# EAGLE schematic draft9 (EAGLE 6.3)
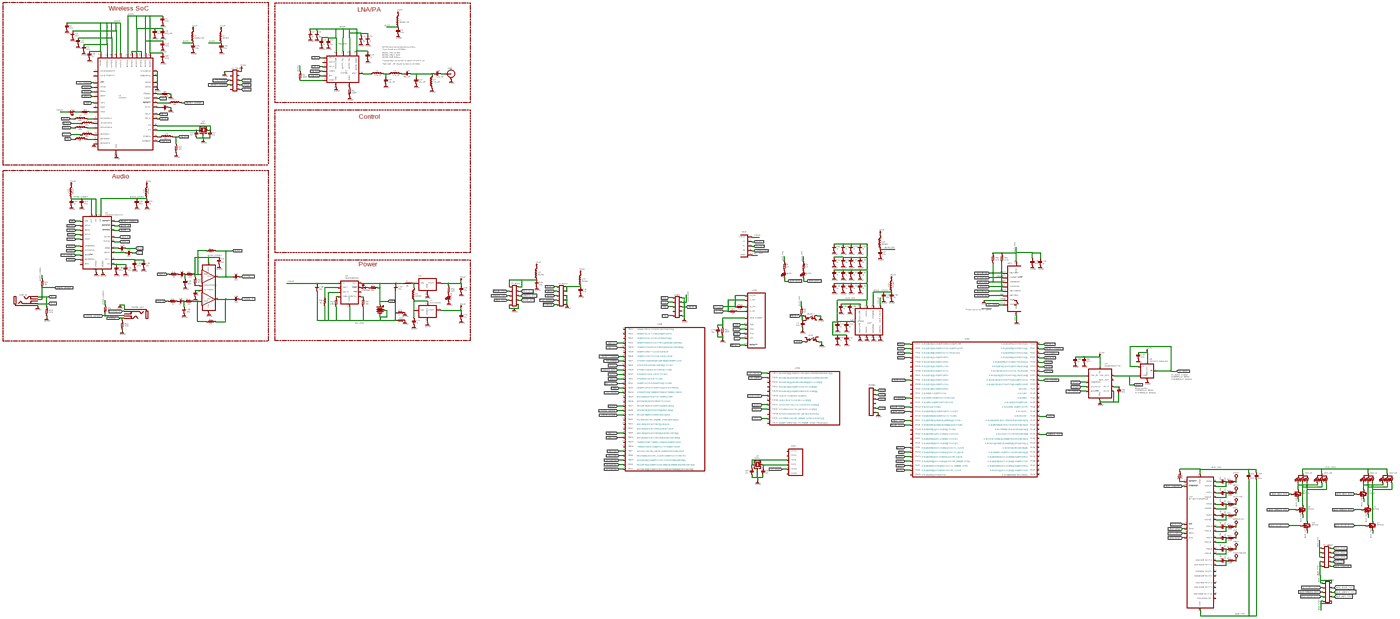
[diagram p0: schematic, sheet 1, overview]
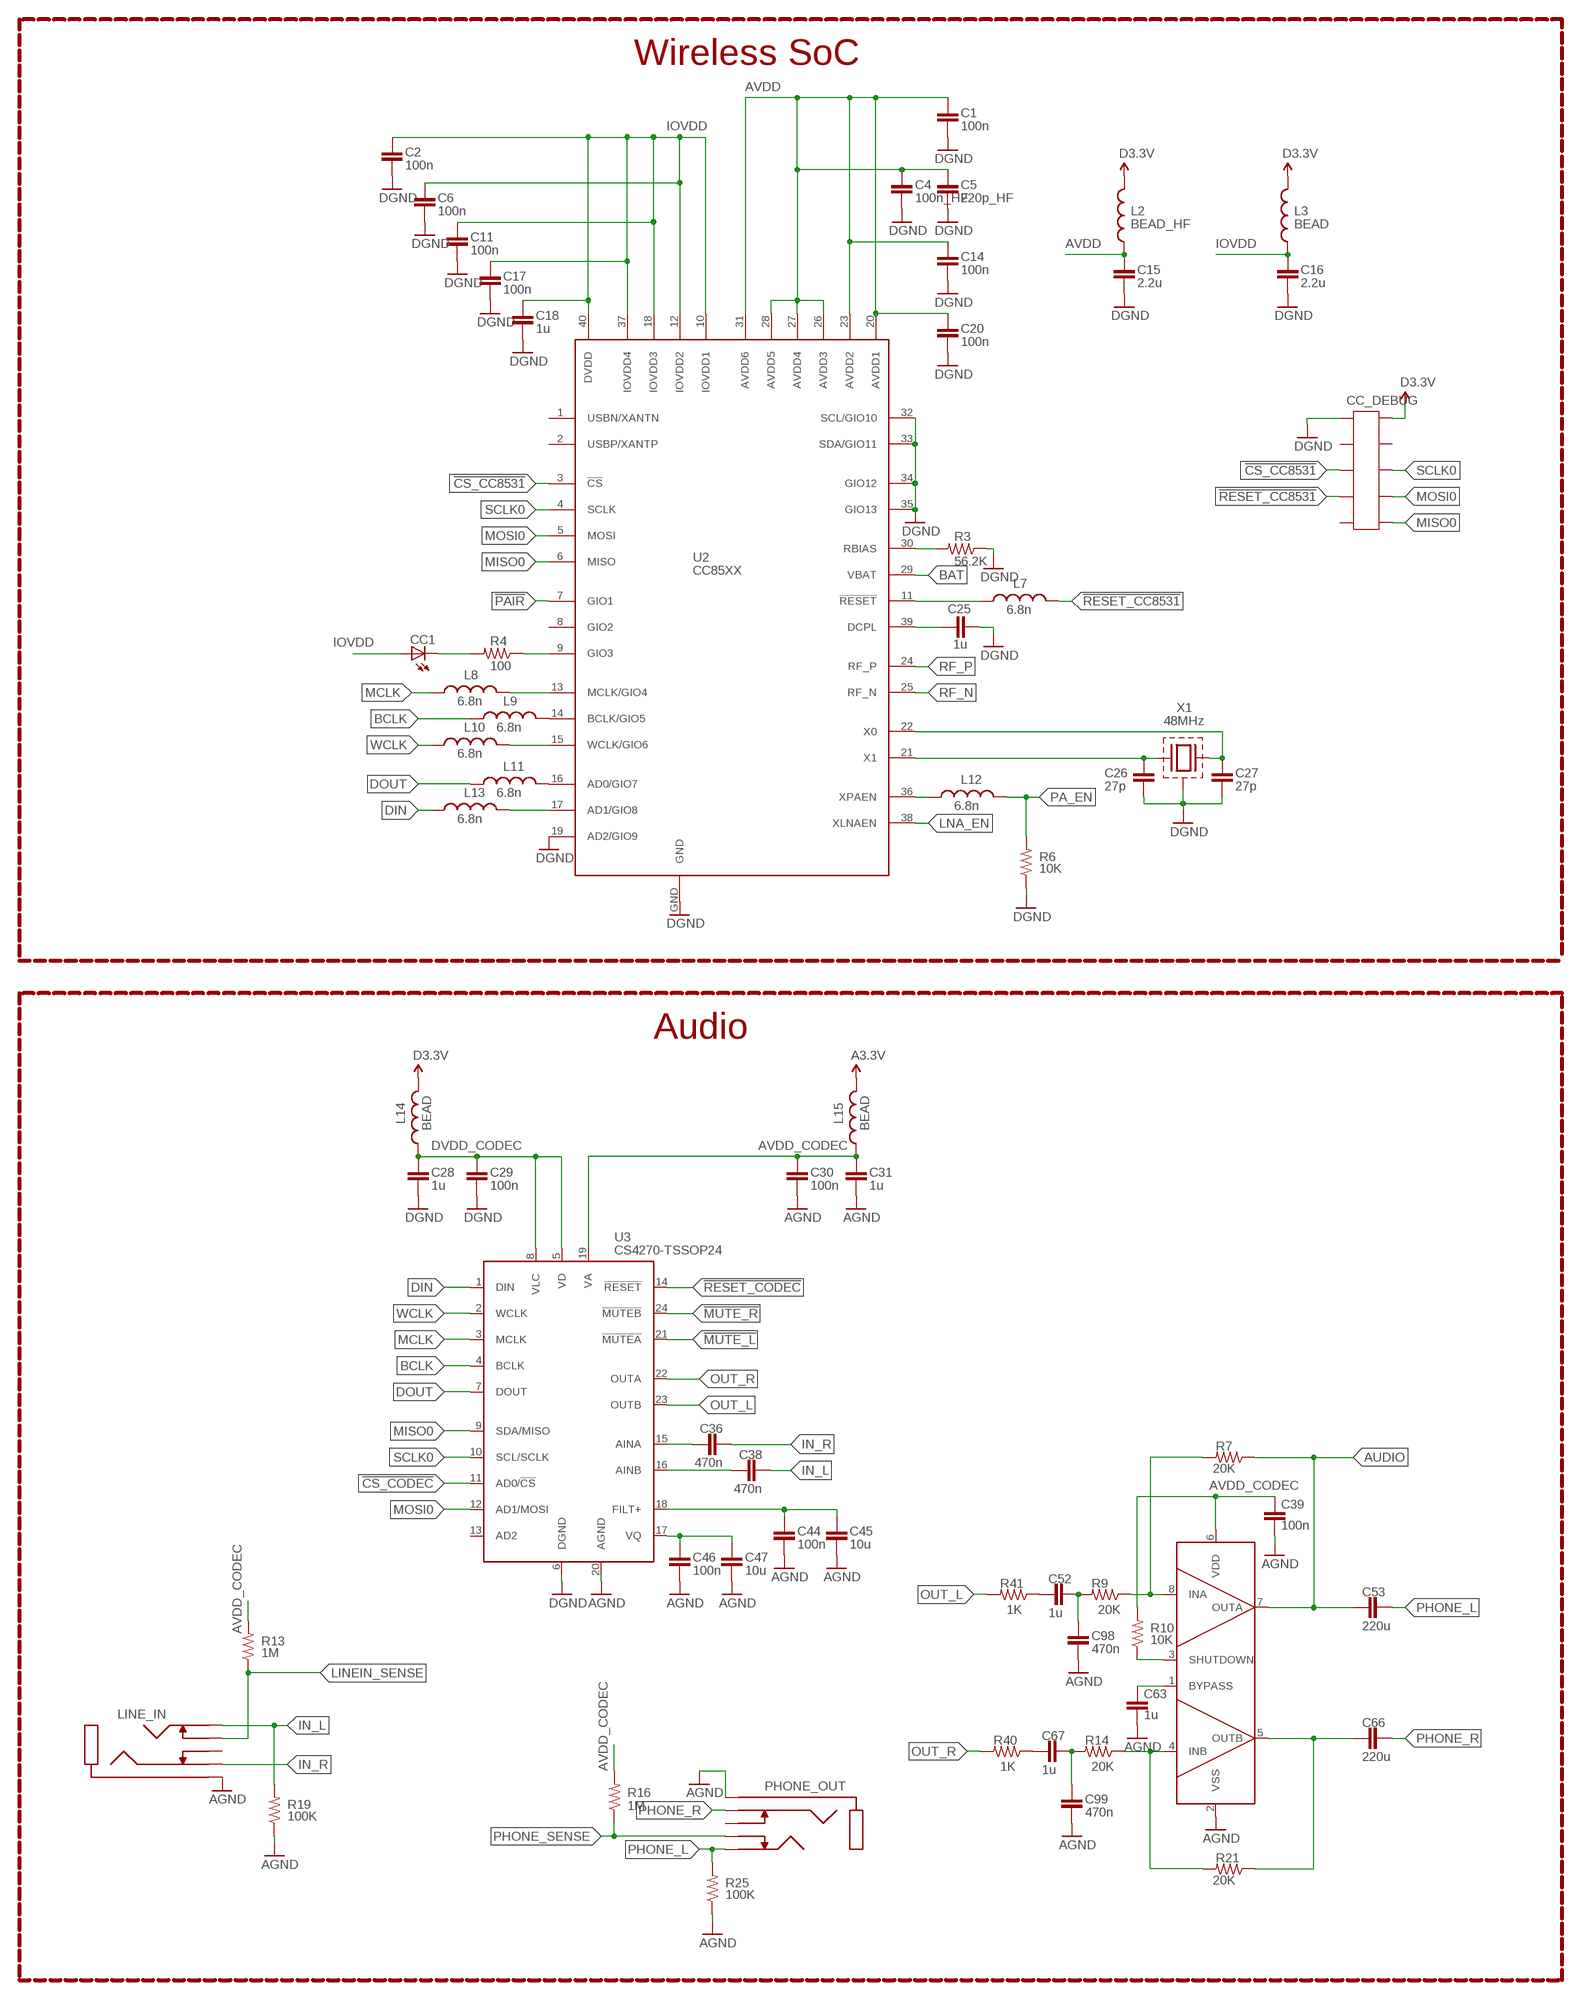
[diagram p1: schematic, sheet 1, part 1 of 4]
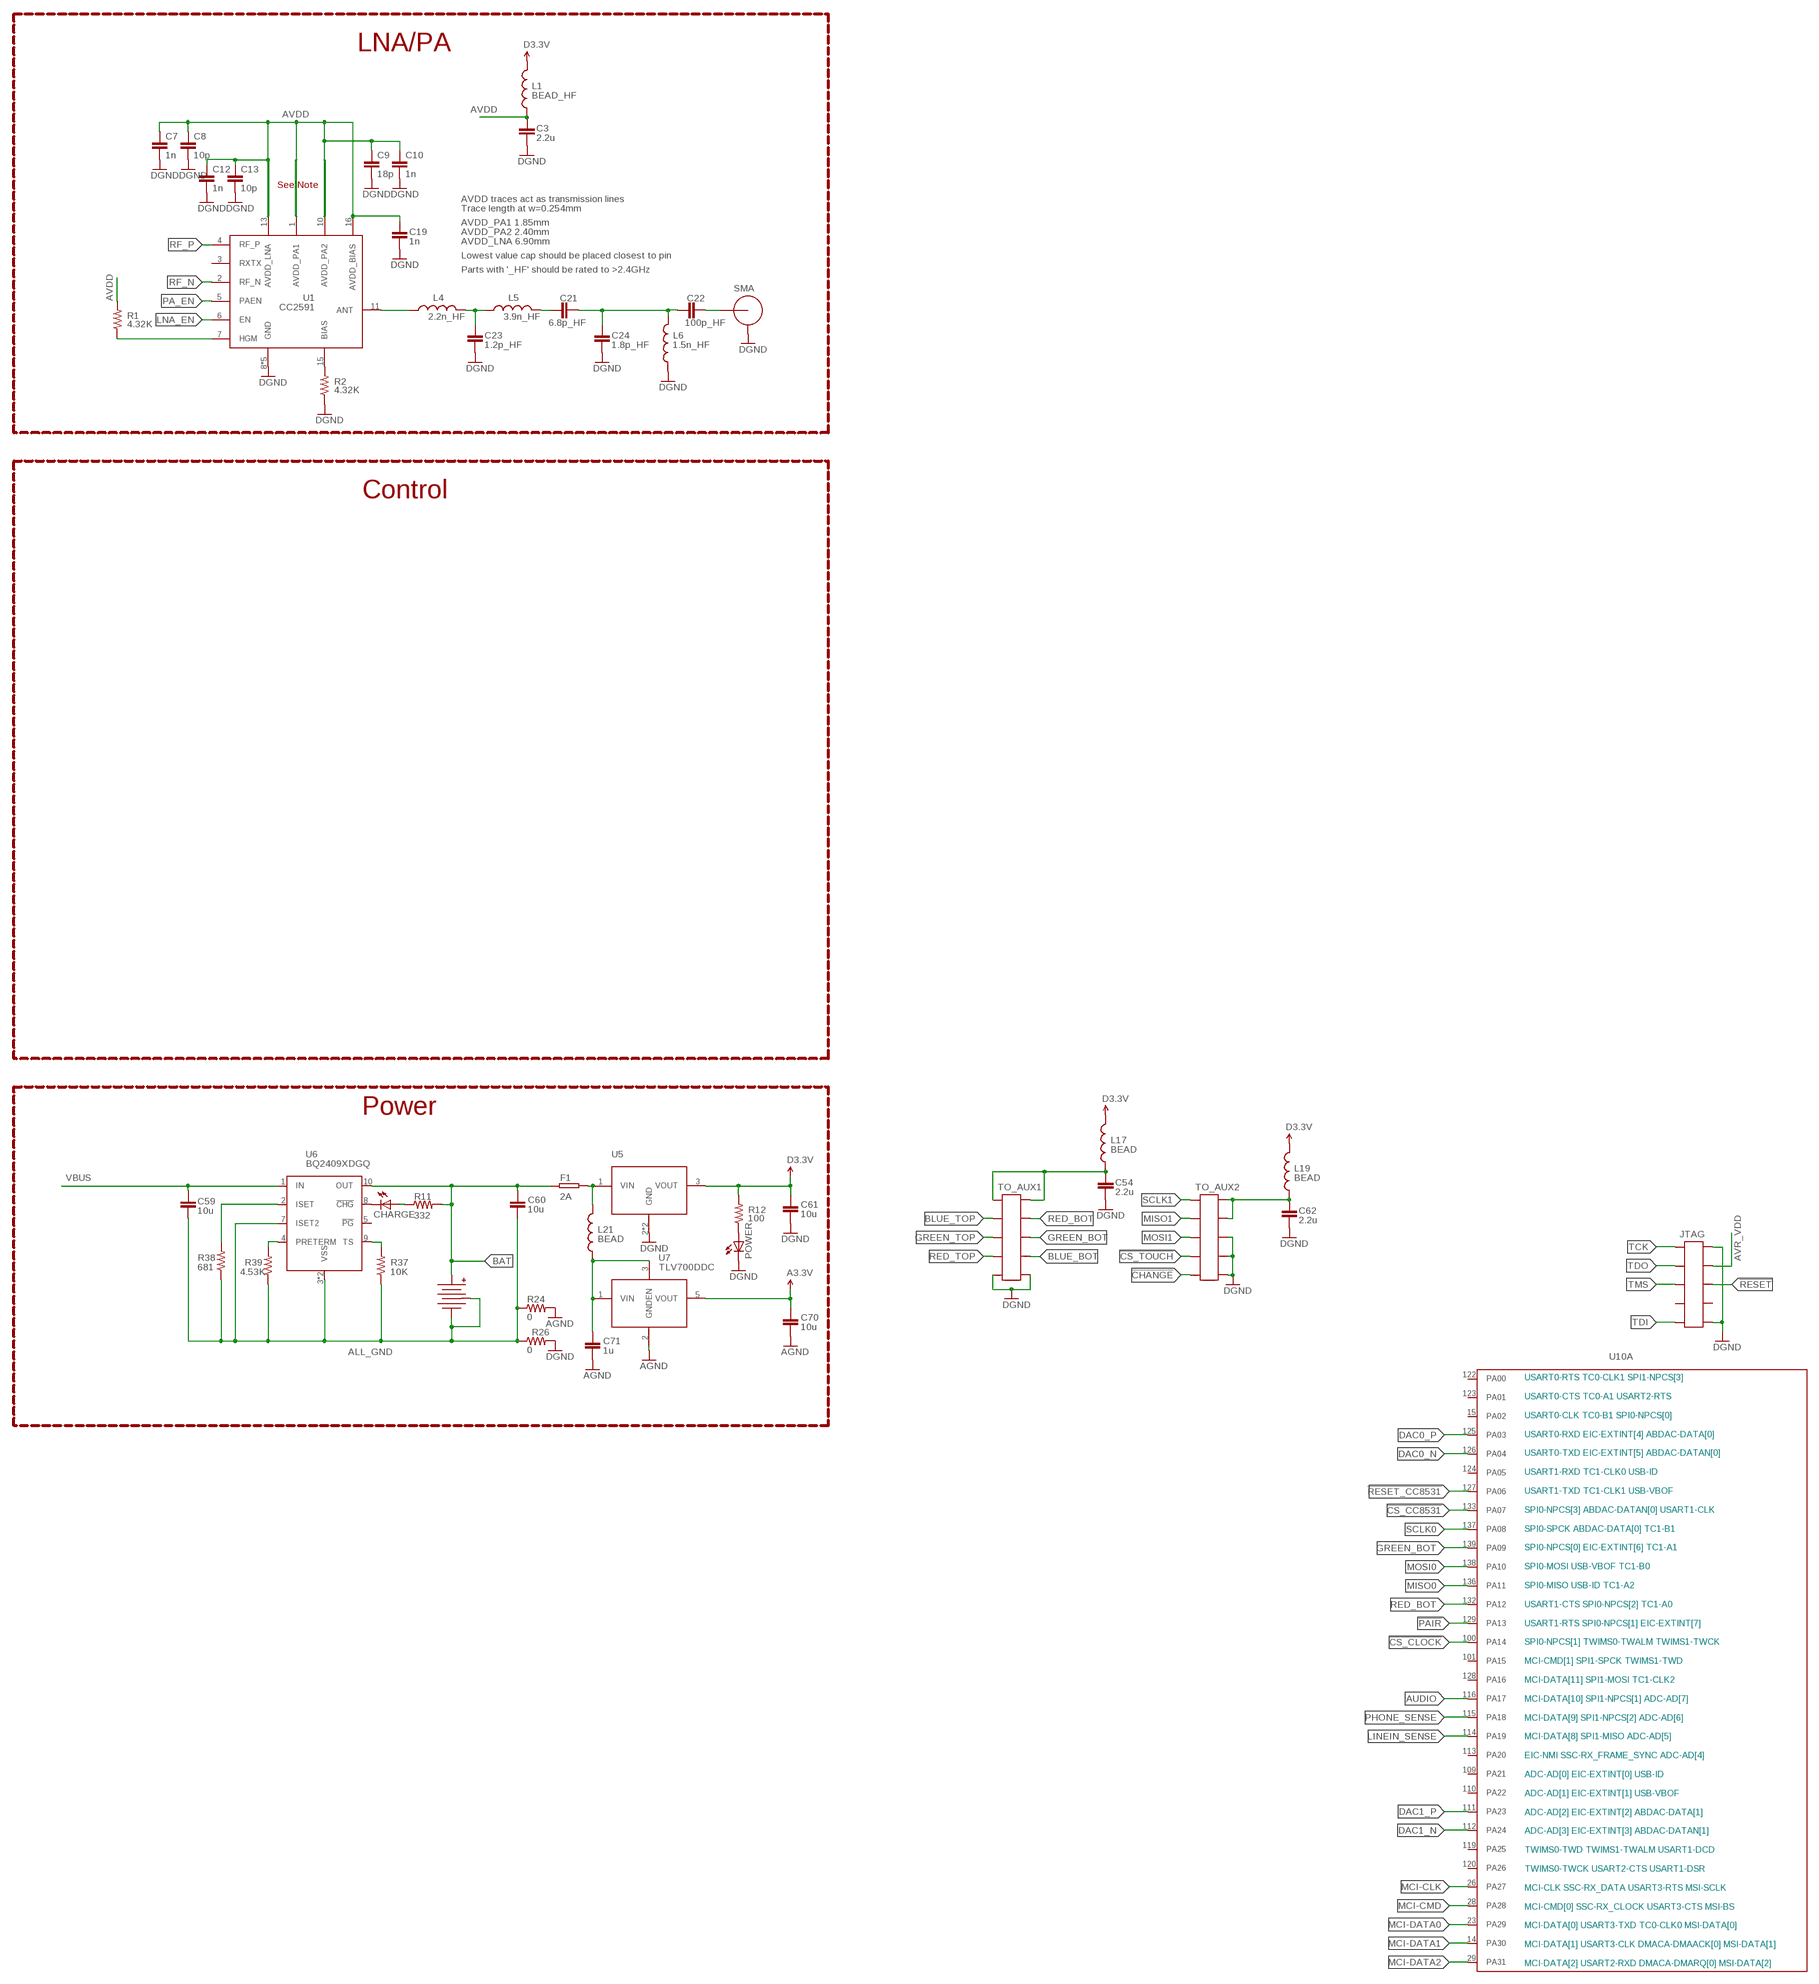
[diagram p2: schematic, sheet 1, part 2 of 4]
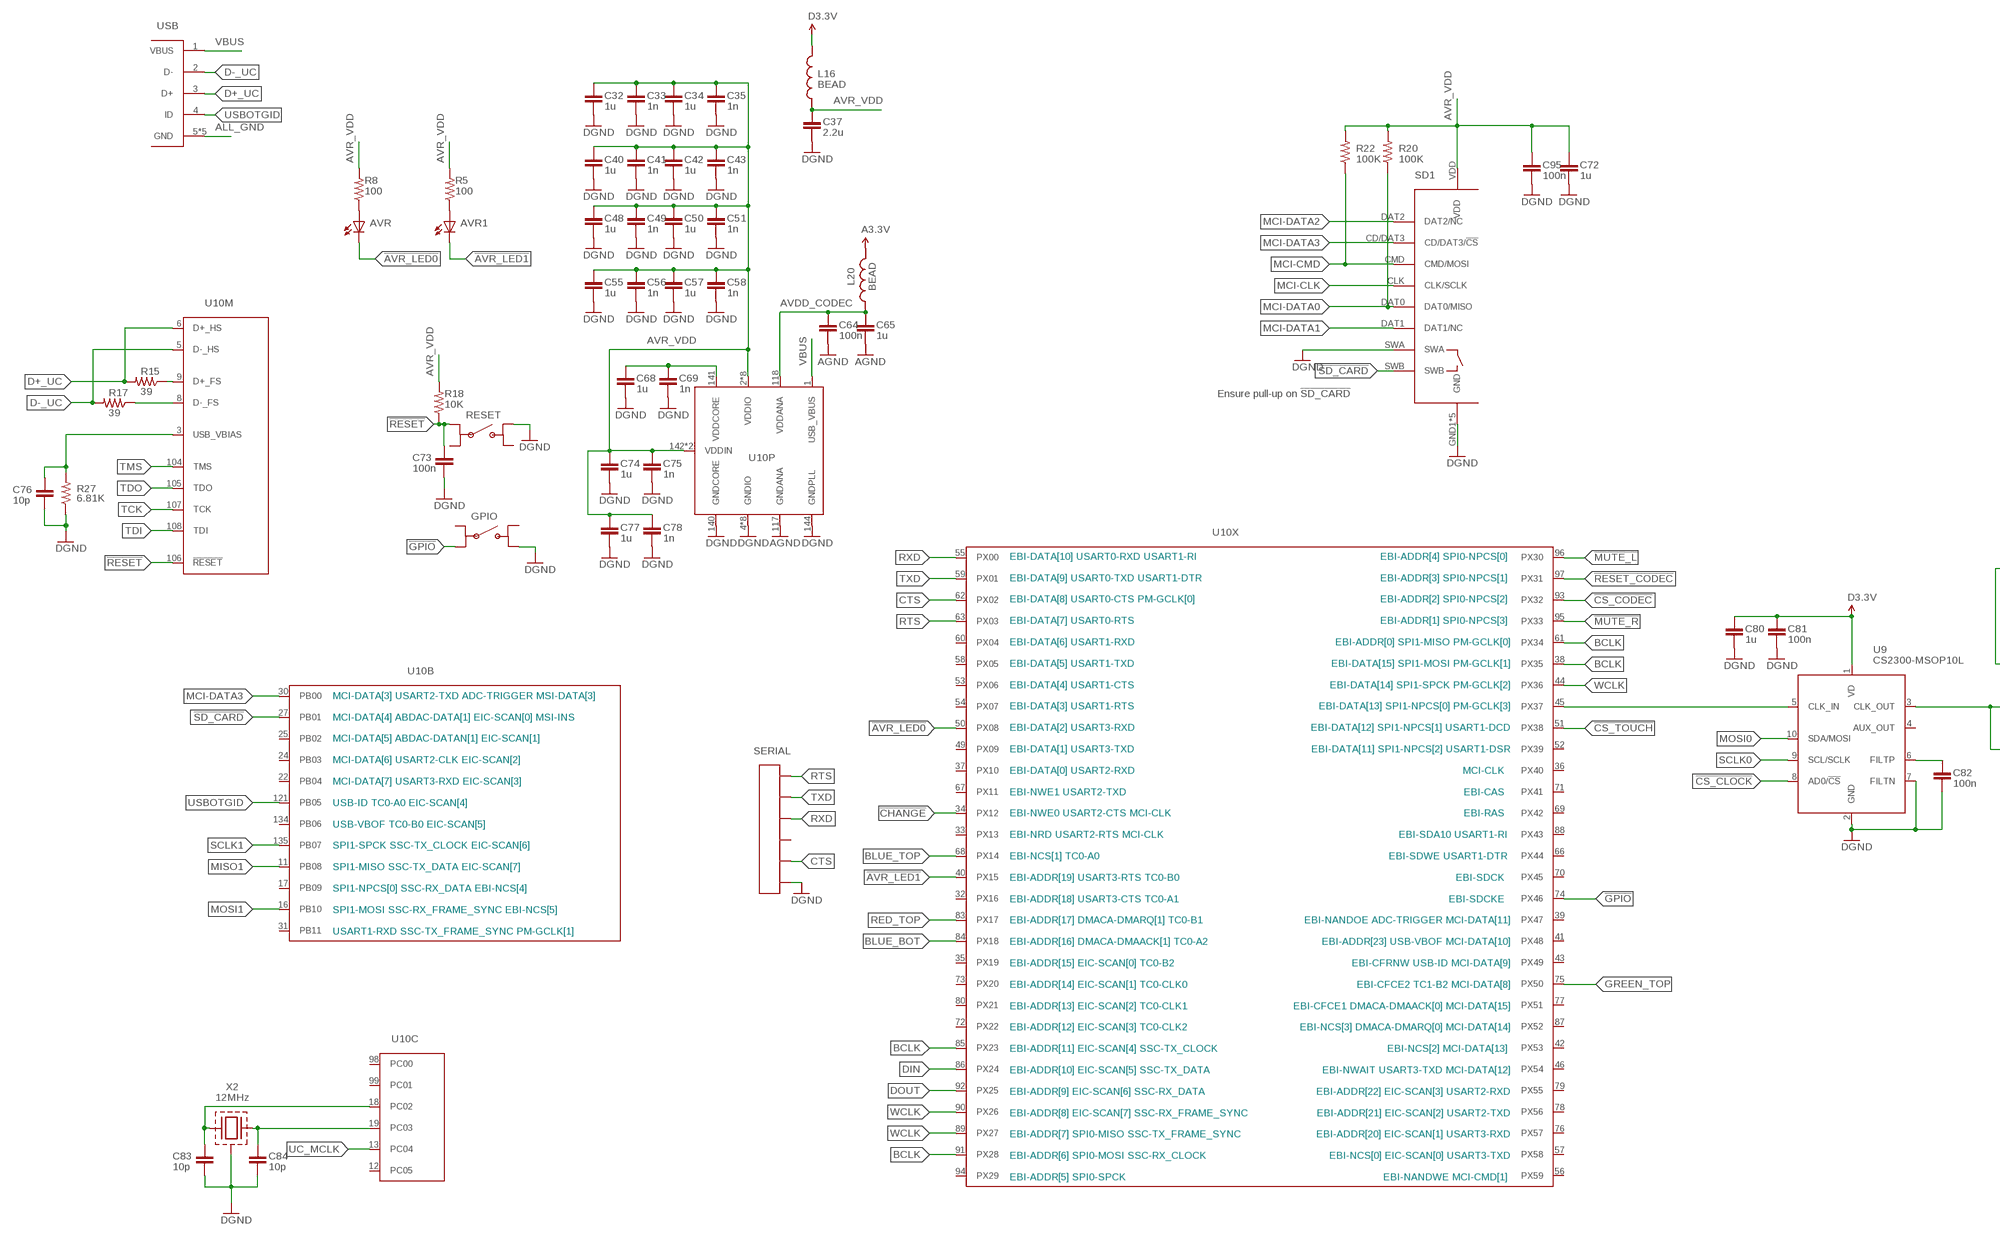
[diagram p3: schematic, sheet 1, part 3 of 4]
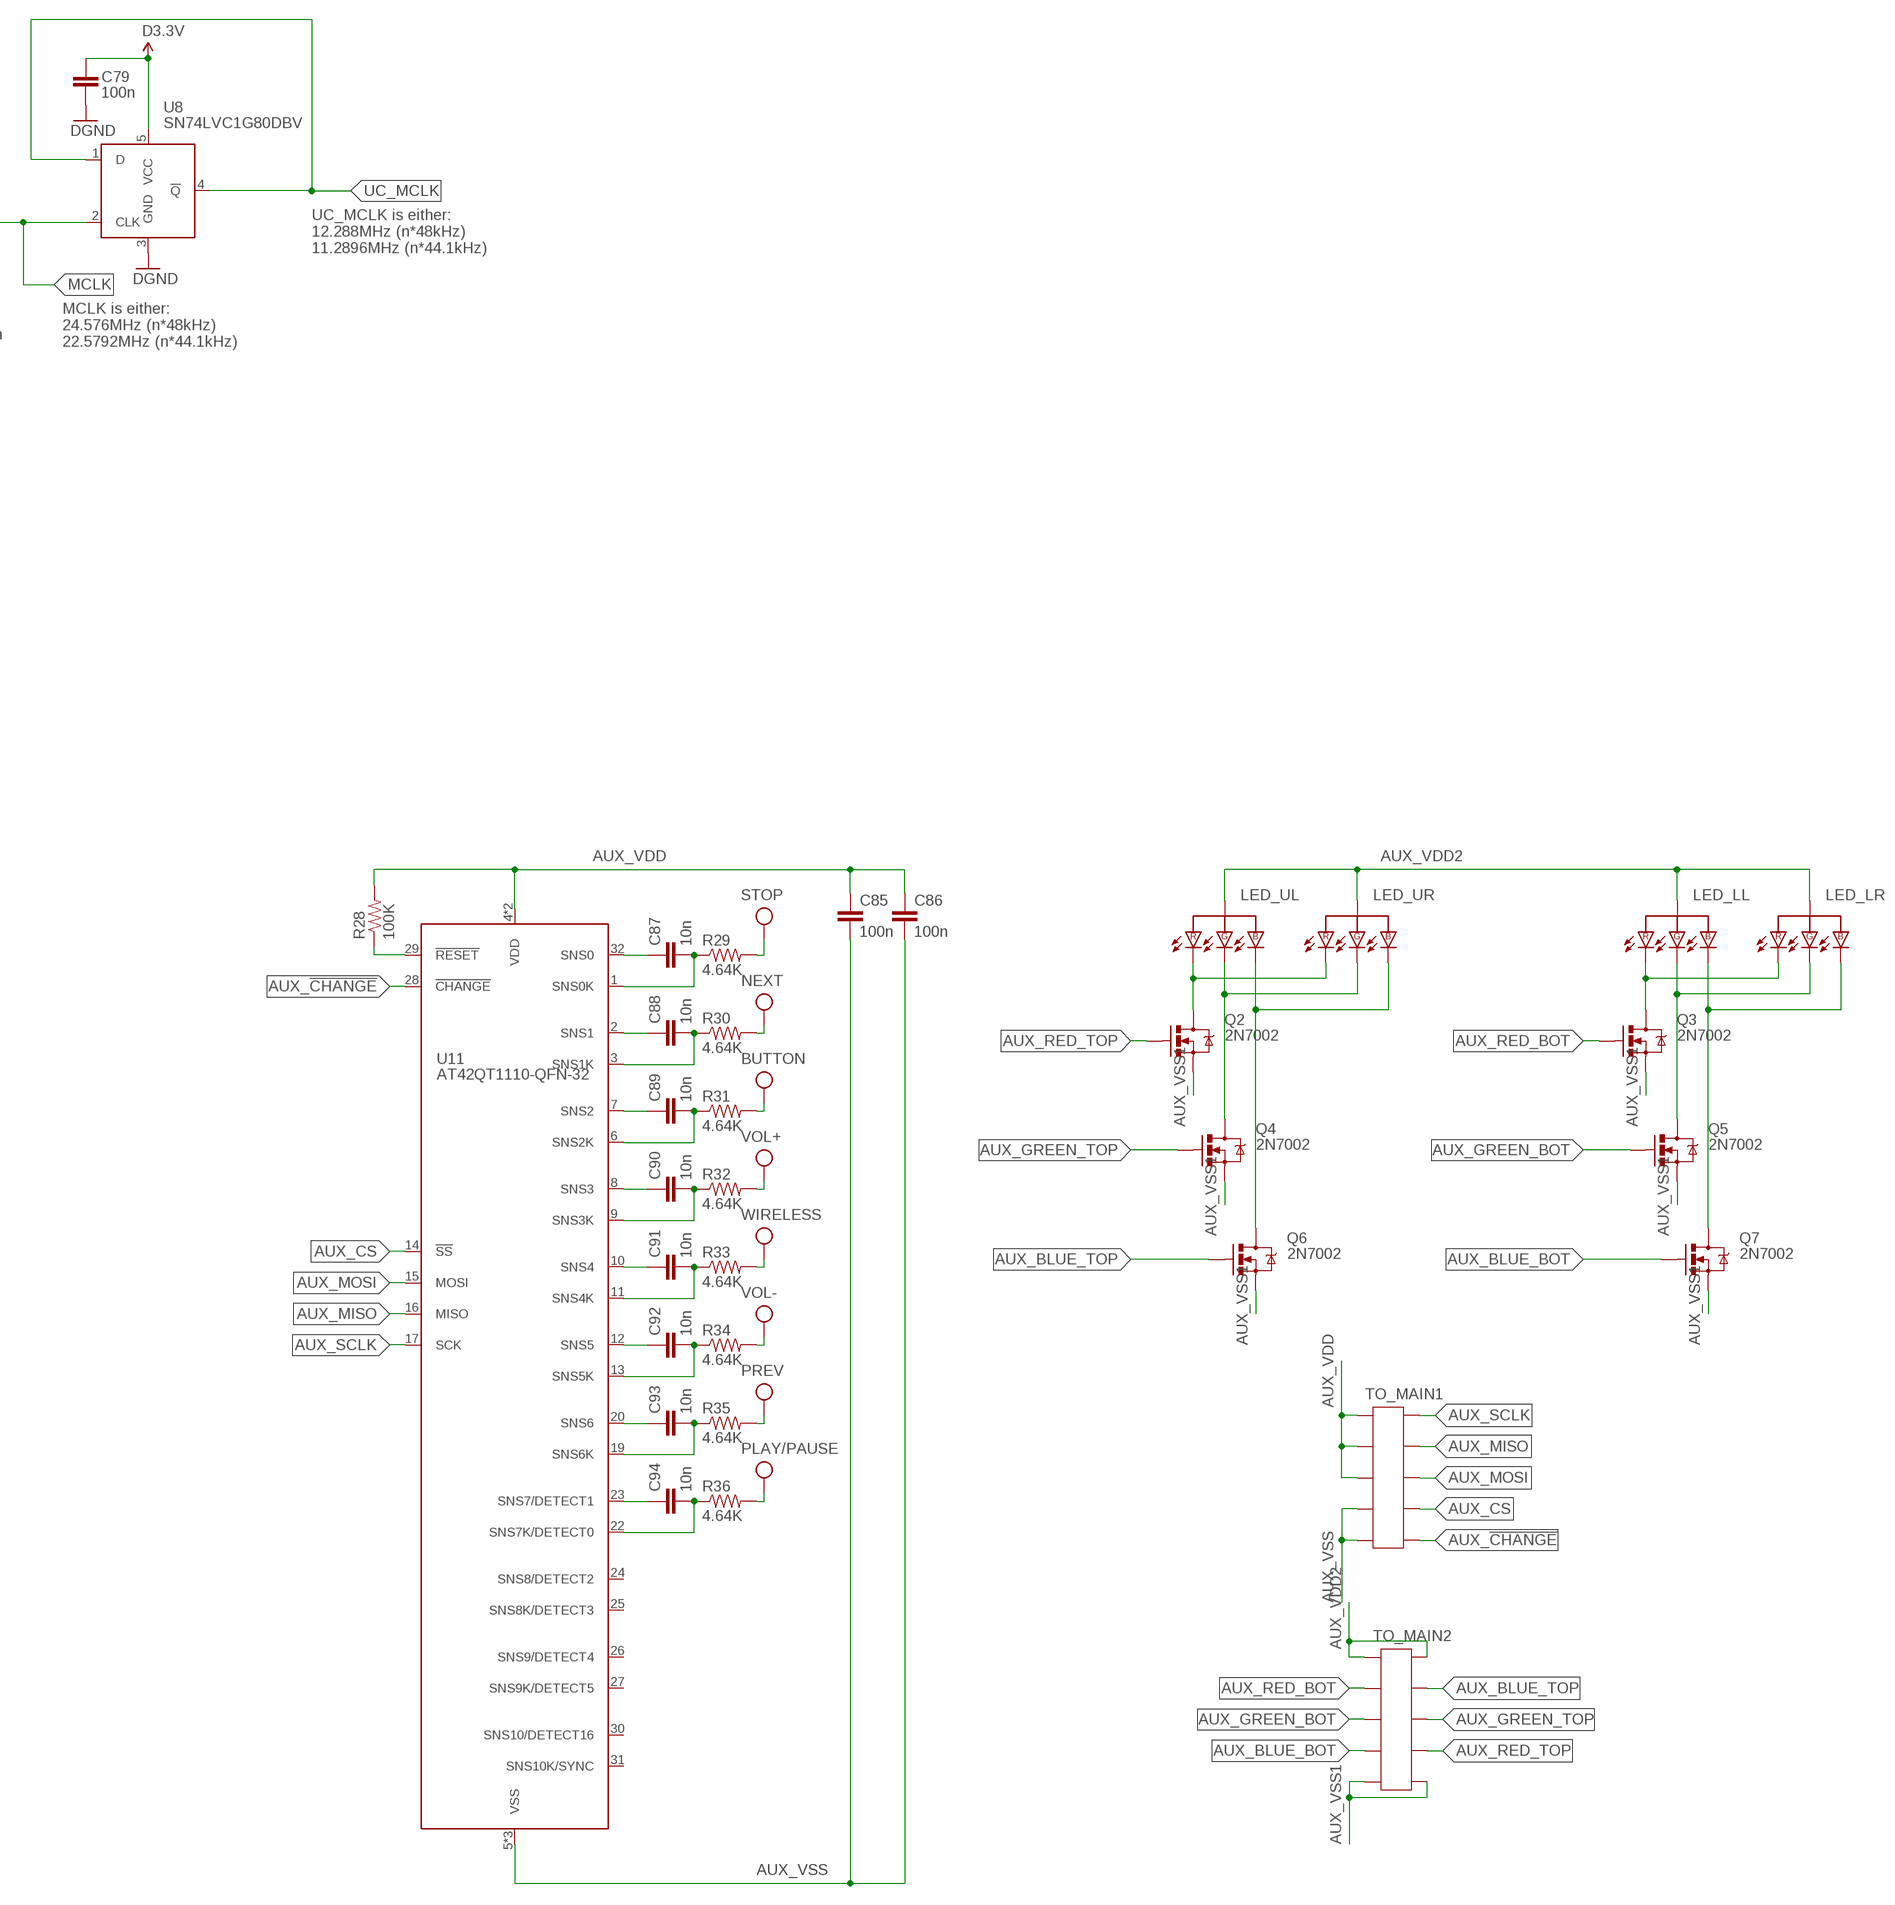
[diagram p4: schematic, sheet 1, part 4 of 4]

## Parts
AVR  LED1206  [LED-1206]
AVR1  LED1206  [LED-1206]
BATTERY  BATTERY-LIPO-JST  [1775469-2]
BUTTON  TOUCH_PAD-CIRCLE-10MM  [TOUCH-CIRCLE-10MM]
C1  100n  C-EUC0603  [C0603]
C2  100n  C-EUC0603  [C0603]
C3  2.2u  C-EUC0603  [C0603]
C4  100n_HF  C-EUC0603  [C0603]
C5  220p_HF  C-EUC0603  [C0603]
C6  100n  C-EUC0603  [C0603]
C7  1n  C-EUC0603  [C0603]
C8  10p  C-EUC0603  [C0603]
C9  18p  C-EUC0603  [C0603]
C10  1n  C-EUC0603  [C0603]
C11  100n  C-EUC0603  [C0603]
C12  1n  C-EUC0603  [C0603]
C13  10p  C-EUC0603  [C0603]
C14  100n  C-EUC0603  [C0603]
C15  2.2u  C-EUC0603  [C0603]
C16  2.2u  C-EUC0603  [C0603]
C17  100n  C-EUC0603  [C0603]
C18  1u  C-EUC0603  [C0603]
C19  1n  C-EUC0603  [C0603]
C20  100n  C-EUC0603  [C0603]
C21  6.8p_HF  C-EUC0603  [C0603]
C22  100p_HF  C-EUC0603  [C0603]
C23  1.2p_HF  C-EUC0603  [C0603]
C24  1.8p_HF  C-EUC0603  [C0603]
C25  1u  C-EUC0603  [C0603]
C26  27p  C-EUC0603  [C0603]
C27  27p  C-EUC0603  [C0603]
C28  1u  C-EUC0603  [C0603]
C29  100n  C-EUC0603  [C0603]
C30  100n  C-EUC0603  [C0603]
C31  1u  C-EUC0603  [C0603]
C32  1u  C-EUC0603  [C0603]
C33  1n  C-EUC0603  [C0603]
C34  1u  C-EUC0603  [C0603]
C35  1n  C-EUC0603  [C0603]
C36  470n  C-EUC0603  [C0603]
C37  2.2u  C-EUC0603  [C0603@1]
C38  470n  C-EUC0603  [C0603]
C39  100n  C-EUC0603  [C0603]
C40  1u  C-EUC0603  [C0603]
C41  1n  C-EUC0603  [C0603]
C42  1u  C-EUC0603  [C0603]
C43  1n  C-EUC0603  [C0603]
C44  100n  C-EUC0603  [C0603]
C45  10u  C-EUC0603  [C0603]
C46  100n  C-EUC0603  [C0603]
C47  10u  C-EUC0603  [C0603]
C48  1u  C-EUC0603  [C0603]
C49  1n  C-EUC0603  [C0603]
C50  1u  C-EUC0603  [C0603]
C51  1n  C-EUC0603  [C0603]
C52  1u  C-EUC0603  [C0603]
C53  220u  C-EUC1210  [C1210]
C54  2.2u  C-EUC0603  [C0603]
C55  1u  C-EUC0603  [C0603]
C56  1n  C-EUC0603  [C0603]
C57  1u  C-EUC0603  [C0603]
C58  1n  C-EUC0603  [C0603]
C59  10u  C-EUC0603  [C0603]
C60  10u  C-EUC0603  [C0603]
C61  10u  C-EUC0603  [C0603]
C62  2.2u  C-EUC0603  [C0603]
C63  1u  C-EUC0603  [C0603]
C64  100n  C-EUC0603  [C0603]
C65  1u  C-EUC0603  [C0603]
C66  220u  C-EUC1210  [C1210]
C67  1u  C-EUC0603  [C0603]
C68  1u  C-EUC0603  [C0603]
C69  1n  C-EUC0603  [C0603]
C70  10u  C-EUC0603  [C0603@1]
C71  1u  C-EUC0603  [C0603]
C72  1u  C-EUC0603  [C0603]
C73  100n  C-EUC0603  [C0603]
C74  1u  C-EUC0603  [C0603]
C75  1n  C-EUC0603  [C0603]
C76  10p  C-EUC0603  [C0603]
C77  1u  C-EUC0603  [C0603]
C78  1n  C-EUC0603  [C0603]
C79  100n  C-EUC0603  [C0603]
C80  1u  C-EUC0603  [C0603]
C81  100n  C-EUC0603  [C0603]
C82  100n  C-EUC0603  [C0603]
C83  10p  C-EUC0603  [C0603]
C84  10p  C-EUC0603  [C0603]
C85  100n  C-EUC0603  [C0603]
C86  100n  C-EUC0603  [C0603]
C87  10n  C-EUC0603  [C0603]
C88  10n  C-EUC0603  [C0603]
C89  10n  C-EUC0603  [C0603]
C90  10n  C-EUC0603  [C0603]
C91  10n  C-EUC0603  [C0603]
C92  10n  C-EUC0603  [C0603]
C93  10n  C-EUC0603  [C0603]
C94  10n  C-EUC0603  [C0603]
C95  100n  C-EUC0603  [C0603]
C98  470n  C-EUC0603  [C0603]
C99  470n  C-EUC0603  [C0603]
CC1  LED1206  [LED-1206]
CC_DEBUG  HEADER-10P-SMD-MALE2  [HEADER-10P-1.27MM]
CHARGE  LED1206  [LED-1206]
F1  2A  PTC_FUSE  [1210]
GPIO  TACT_SWITCH-PTS-525  [PTS-525]
JTAG  HEADER-10P-SMD-MALE2  [HEADER-10P-1.27MM]
L1  BEAD_HF  INDUCTOR0603  [0603]
L2  BEAD_HF  INDUCTOR0603  [0603]
L3  BEAD  INDUCTOR0603  [0603]
L4  2.2n_HF  INDUCTOR0603  [0603]
L5  3.9n_HF  INDUCTOR0603  [0603]
L6  1.5n_HF  INDUCTOR0603  [0603]
L7  6.8n  INDUCTOR0603  [0603]
L8  6.8n  INDUCTOR0603  [0603]
L9  6.8n  INDUCTOR0603  [0603]
L10  6.8n  INDUCTOR0603  [0603]
L11  6.8n  INDUCTOR0603  [0603]
L12  6.8n  INDUCTOR0603  [0603@1]
L13  6.8n  INDUCTOR0603  [0603]
L14  BEAD  INDUCTOR0603  [0603]
L15  BEAD  INDUCTOR0603  [0603@1]
L16  BEAD  INDUCTOR0603  [0603@1]
L17  BEAD  INDUCTOR0603  [0603]
L19  BEAD  INDUCTOR0603  [0603]
L20  BEAD  INDUCTOR0603  [0603]
L21  BEAD  INDUCTOR0603  [0603]
LED_LL  LED_RGB  [PLCC-4]
LED_LR  LED_RGB  [PLCC-4]
LED_UL  LED_RGB  [PLCC-4]
LED_UR  LED_RGB  [PLCC-4]
LINE_IN  PHONE_SW-STX-35332-5N  [STX-35332-5N]
NEXT  TOUCH_PAD-CIRCLE-10MM  [TOUCH-CIRCLE-10MM]
PHONE_OUT  PHONE_SW-STX-35332-5N  [STX-35332-5N]
PLAY/PAUSE  TOUCH_PAD-CIRCLE-10MM  [TOUCH-CIRCLE-10MM]
POWER  LED1206  [LED-1206]
PREV  TOUCH_PAD-CIRCLE-10MM  [TOUCH-CIRCLE-10MM]
Q2  2N7002  MOSFET-NCHANNELSMD  [SOT23-3]
Q3  2N7002  MOSFET-NCHANNELSMD  [SOT23-3]
Q4  2N7002  MOSFET-NCHANNELSMD  [SOT23-3]
Q5  2N7002  MOSFET-NCHANNELSMD  [SOT23-3]
Q6  2N7002  MOSFET-NCHANNELSMD  [SOT23-3]
Q7  2N7002  MOSFET-NCHANNELSMD  [SOT23-3]
R1  4.32K  R-US_R0603  [R0603]
R2  4.32K  R-US_R0603  [R0603]
R3  56.2K  R-US_R0603  [R0603]
R4  100  R-US_R0603  [R0603]
R5  100  R-US_R0603  [R0603]
R6  10K  R-US_R0603  [R0603]
R7  20K  R-US_R0603  [R0603]
R8  100  R-US_R0603  [R0603]
R9  20K  R-US_R0603  [R0603]
R10  10K  R-US_R0603  [R0603@1]
R11  332  R-US_R0603  [R0603]
R12  100  R-US_R0603  [R0603]
R13  1M  R-US_R0603  [R0603]
R14  20K  R-US_R0603  [R0603]
R15  39  R-US_R0603  [R0603]
R16  1M  R-US_R0603  [R0603]
R17  39  R-US_R0603  [R0603]
R18  10K  R-US_R0603  [R0603]
R19  100K  R-US_R0603  [R0603]
R20  100K  R-US_R0603  [R0603]
R21  20K  R-US_R0603  [R0603]
R22  100K  R-US_R0603  [R0603]
R24  0  R-US_R0603  [R0603]
R25  100K  R-US_R0603  [R0603]
R26  0  R-US_R0603  [R0603]
R27  6.81K  R-US_R0603  [R0603]
R28  100K  R-US_R0603  [R0603]
R29  4.64K  R-US_R0603  [R0603]
R30  4.64K  R-US_R0603  [R0603]
R31  4.64K  R-US_R0603  [R0603]
R32  4.64K  R-US_R0603  [R0603]
R33  4.64K  R-US_R0603  [R0603]
R34  4.64K  R-US_R0603  [R0603]
R35  4.64K  R-US_R0603  [R0603]
R36  4.64K  R-US_R0603  [R0603]
R37  10K  R-US_R0603  [R0603]
R38  681  R-US_R0603  [R0603]
R39  4.53K  R-US_R0603  [R0603]
R40  1K  R-US_R0603  [R0603]
R41  1K  R-US_R0603  [R0603]
RESET  TACT_SWITCH-PTS-525  [PTS-525]
SD1  MICROSD104031-0811  [MOLEX_104031-0811]
SERIAL  HEADER-6X1-961106-5500  [HEADER-3M-961-6P-2.54MM]
SMA  SMA-REVSMA-0.62  [CONREVSMA003.062]
STOP  TOUCH_PAD-CIRCLE-10MM  [TOUCH-CIRCLE-10MM]
TO_AUX1  HEADER-10P-SMD-2MM-FEMALE  [M22-63405]
TO_AUX2  HEADER-10P-SMD-2MM-FEMALE  [M22-63405]
TO_MAIN1  HEADER-10P-SMD-2MM-MALE  [M22-53205]
TO_MAIN2  HEADER-10P-SMD-2MM-MALE  [M22-53205]
U1  CC2591  [S-PVQFN-N16]
U2  CC85XX  [S-PVQFN-N40]
U3  CS4270-TSSOP24  [TSSOP-24L]
U4  LM4881  [SO08]
U5  MCP1826-SOT223  [SOT-223]
U6  BQ2409XDGQ  [S-PDSO-G10]
U7  TLV700DDC  [SOT-23-5]
U8  SN74LVC1G80DBV  [SOT-23-5]
U9  CS2300-MSOP10L  [MSOP-10L]
U10  AT32UC3A3-LQFP-144  [LQFP-144]
U11  AT42QT1110-QFN-32  [QFN-32]
USB  USB_MICRO_AB  [USB_MICRO_AB]
VOL+  TOUCH_PAD-CIRCLE-10MM  [TOUCH-CIRCLE-10MM]
VOL-  TOUCH_PAD-CIRCLE-10MM  [TOUCH-CIRCLE-10MM]
WIRELESS  TOUCH_PAD-CIRCLE-10MM  [TOUCH-CIRCLE-10MM]
X1  48MHz  XTAL-ABRACONABM3C  [ABM3C]
X2  12MHz  XTAL-ABRACONABM8G  [ABM8G]

## Nets
!AVR_LED0: AVR.C U10.50(X:PX08)
!AVR_LED1: AVR1.C U10.40(X:PX15)
!CHANGE: TO_AUX2.9 U10.34(X:PX12)
!CS_CC8531: CC_DEBUG.5 U2.3(!CS) U10.133(A:PA07)
!CS_CLOCK: U9.8(AD0/!CS) U10.100(A:PA14)
!CS_CODEC: U3.11(AD0/!CS) U10.93(X:PX32)
!CS_TOUCH: TO_AUX2.7 U10.51(X:PX38)
!GPIO: GPIO.2 U10.74(X:PX46)
!MUTE_L: U3.21(!MUTEA) U10.96(X:PX30)
!MUTE_R: U3.24(!MUTEB) U10.95(X:PX33)
!PAIR: U2.7(GIO1) U10.129(A:PA13)
!RESET: C73.1 JTAG.6 R18.1 RESET.1 U10.106(M:!RESET)
!RESET_CC8531: CC_DEBUG.7 L7.2 U10.127(A:PA06)
!RESET_CODEC: U3.14(!RESET) U10.97(X:PX31)
!SD_CARD: SD1.SWB U10.27(B:PB01)
A3.3V: C70.1 L15.2 L20.2 U7.5(VOUT)
AGND [Analog]: C30.2 C31.2 C39.2 C44.2 C45.2 C46.2 C47.2 C63.2 C64.2 C65.2 C70.2 C71.2 C98.2 C99.2 LINE_IN.5(GND) PHONE_OUT.5(GND) R19.1 R24.2 R25.1 U3.20(AGND) U4.2(VSS) U7.2(GND) U10.117(P:GNDANA)
ALL_GND [Power]: BATTERY.-(N) BATTERY.X1(CASE) BATTERY.X2(CASE) C59.2 C60.2 R24.1 R26.1 R37.1 R38.1 R39.1 U6.3(VSS) U6.7(ISET2) U6.GND(VSS) USB.5(GND) USB.GND1(GND) USB.GND2(GND) USB.GND3(GND) USB.GND4(GND)
AUDIO: C53.1 R7.1 U4.7(OUTA) U10.116(A:PA17)
AUX_!CHANGE: TO_MAIN1.10 U11.28(!CHANGE)
AUX_BLUE_BOT: Q7.1(G) TO_MAIN2.7
AUX_BLUE_TOP: Q6.1(G) TO_MAIN2.4
AUX_CS: TO_MAIN1.8 U11.14(!SS)
AUX_GREEN_BOT: Q5.1(G) TO_MAIN2.5
AUX_GREEN_TOP: Q4.1(G) TO_MAIN2.6
AUX_MISO: TO_MAIN1.4 U11.16(MISO)
AUX_MOSI: TO_MAIN1.6 U11.15(MOSI)
AUX_RED_BOT: Q3.1(G) TO_MAIN2.3
AUX_RED_TOP: Q2.1(G) TO_MAIN2.8
AUX_SCLK: TO_MAIN1.2 U11.17(SCK)
AUX_VDD: C85.1 C86.1 R28.2 TO_MAIN1.1 TO_MAIN1.3 TO_MAIN1.5 U11.4(VDD) U11.18(VDD)
AUX_VDD2: LED_LL.2(A) LED_LL.2-2(A) LED_LR.2(A) LED_LR.2-2(A) LED_UL.2(A) LED_UL.2-2(A) LED_UR.2(A) LED_UR.2-2(A) TO_MAIN2.1 TO_MAIN2.2
AUX_VSS: C85.2 C86.2 TO_MAIN1.7 TO_MAIN1.9 U11.5(VSS) U11.21(VSS) U11.GND(VSS)
AUX_VSS1: Q2.2(S) Q3.2(S) Q4.2(S) Q5.2(S) Q6.2(S) Q7.2(S) TO_MAIN2.9 TO_MAIN2.10
AVDD: C1.1 C3.1 C4.1 C5.1 C7.1 C8.1 C9.1 C10.1 C12.1 C13.1 C14.1 C15.1 C19.1 C20.1 L1.1 L2.1 R1.2 U1.1(AVDD_PA1) U1.10(AVDD_PA2) U1.13(AVDD_LNA) U1.16(AVDD_BIAS) U2.20(AVDD1) U2.23(AVDD2) U2.26(AVDD3) U2.27(AVDD4) U2.28(AVDD5) U2.31(AVDD6)
AVDD_CODEC: C30.1 C31.1 C39.1 C64.1 C65.1 L15.1 L20.1 R10.2 R13.2 R16.2 U3.19(VA) U4.6(VDD) U10.118(P:VDDANA)
AVR_VDD: C32.1 C33.1 C34.1 C35.1 C37.1 C40.1 C41.1 C42.1 C43.1 C48.1 C49.1 C50.1 C51.1 C55.1 C56.1 C57.1 C58.1 C72.1 C74.1 C75.1 C77.1 C78.1 C95.1 JTAG.4 L16.1 R5.2 R8.2 R18.2 R20.2 R22.2 SD1.VDD U10.2(P:VDDIO) U10.10(P:VDDIO) U10.21(P:VDDIO) U10.48(P:VDDIO) U10.64(P:VDDIO) U10.81(P:VDDIO) U10.103(P:VDDIO) U10.130(P:VDDIO) U10.142(P:VDDIN) U10.143(P:VDDIN)
BAT [Power]: BATTERY.+(P) C60.1 F1.1 R11.2 U2.29(VBAT) U6.10(OUT)
BCLK: L9.1 U3.4(BCLK) U10.38(X:PX35) U10.61(X:PX34) U10.85(X:PX23) U10.91(X:PX28)
BLUE_BOT: TO_AUX1.8 U10.84(X:PX18)
BLUE_TOP: TO_AUX1.3 U10.68(X:PX14)
CTS: SERIAL.5 U10.62(X:PX02)
D3.3V: C61.1 C79.1 C80.1 C81.1 CC_DEBUG.2 L1.2 L2.2 L3.2 L14.2 L16.2 L17.2 L19.2 R12.2 U5.3(VOUT) U8.5(VCC) U9.1(VD)
D+_UC: R15.2 U10.6(M:D+_HS) USB.3(D+)
D-_UC: R17.2 U10.5(M:D-_HS) USB.2(D-)
DAC0_N: U10.126(A:PA04)
DAC0_P: U10.125(A:PA03)
DAC1_N: U10.112(A:PA24)
DAC1_P: U10.111(A:PA23)
DGND: C1.2 C2.2 C3.2 C4.2 C5.2 C6.2 C7.2 C8.2 C9.2 C10.2 C11.2 C12.2 C13.2 C14.2 C15.2 C16.2 C17.2 C18.2 C19.2 C20.2 C23.2 C24.2 C25.2 C26.2 C27.2 C28.2 C29.2 C32.2 C33.2 C34.2 C35.2 C37.2 C40.2 C41.2 C42.2 C43.2 C48.2 C49.2 C50.2 C51.2 C54.2 C55.2 C56.2 C57.2 C58.2 C61.2 C62.2 C68.2 C69.2 C72.2 C73.2 C74.2 C75.2 C76.2 C77.2 C78.2 C79.2 C80.2 C81.2 C82.2 C83.2 C84.2 C95.2 CC_DEBUG.1 GPIO.4 JTAG.2 JTAG.10 L6.1 POWER.C R2.1 R3.1 R6.1 R26.2 R27.1 RESET.3 SD1.GND1(GND) SD1.GND2(GND) SD1.GND3(GND) SD1.GND4(GND) SD1.SWA SD1.VSS(GND) SERIAL.6 SMA.GND1(GND) SMA.GND2(GND) SMA.GND3(GND) SMA.GND4(GND) TO_AUX1.9 TO_AUX1.10 TO_AUX2.6 TO_AUX2.8 TO_AUX2.10 U1.8(GND) U1.9(GND) U1.12(GND) U1.14(GND) U1.GND U2.19(AD2/GIO9) U2.32(SCL/GIO10) U2.33(SDA/GIO11) U2.34(GIO12) U2.35(GIO13) U2.GND U3.6(DGND) U5.2(GND) U5.4(GND) U8.3(GND) U9.2(GND) U9.7(FILTN) U10.4(P:GNDIO) U10.7(P:GNDIO) U10.20(P:GNDIO) U10.47(P:GNDIO) U10.65(P:GNDIO) U10.82(P:GNDIO) U10.102(P:GNDIO) U10.131(P:GNDIO) U10.140(P:GNDCORE) U10.144(P:GNDPLL) X1.2(CASE) X1.4(CASE) X2.GND-1(CASE) X2.GND-2(CASE)
DIN: L13.1 U3.1(DIN) U10.86(X:PX24)
DOUT: L11.1 U3.7(DOUT) U10.92(X:PX25)
DVDD_CODEC: C28.1 C29.1 L14.1 U3.5(VD) U3.8(VLC)
GREEN_BOT: TO_AUX1.6 U10.139(A:PA09)
GREEN_TOP: TO_AUX1.5 U10.75(X:PX50)
IN_L: C38.1 LINE_IN.4(L) R19.2
IN_R: C36.1 LINE_IN.1(R)
IOVDD: C2.1 C6.1 C11.1 C16.1 C17.1 C18.1 CC1.A L3.1 U2.10(IOVDD1) U2.12(IOVDD2) U2.18(IOVDD3) U2.37(IOVDD4) U2.40(DVDD)
LINEIN_SENSE: LINE_IN.3(L_SW) R13.1 U10.114(A:PA19)
LNA_EN: U1.6(EN) U2.38(XLNAEN)
MCI-CLK: SD1.CLK(CLK/SCLK) U10.26(A:PA27)
MCI-CMD: R22.1 SD1.CMD(CMD/MOSI) U10.28(A:PA28)
MCI-DATA0: R20.1 SD1.DAT0(DAT0/MISO) U10.23(A:PA29)
MCI-DATA1: SD1.DAT1(DAT1/NC) U10.14(A:PA30)
MCI-DATA2: SD1.DAT2(DAT2/NC) U10.29(A:PA31)
MCI-DATA3: SD1.CD/DAT3(CD/DAT3/!CS) U10.30(B:PB00)
MCLK: L8.1 U3.3(MCLK) U8.2(CLK) U9.3(CLK_OUT)
MISO0: CC_DEBUG.10 U2.6(MISO) U3.9(SDA/MISO) U10.136(A:PA11)
MISO1: TO_AUX2.3 U10.11(B:PB08)
MOSI0: CC_DEBUG.8 U2.5(MOSI) U3.12(AD1/MOSI) U9.10(SDA/MOSI) U10.138(A:PA10)
MOSI1: TO_AUX2.5 U10.16(B:PB10)
N$1: C26.1 U2.21(X1) X1.1
N$2: C27.1 U2.22(X0) X1.3
N$3: L7.1 U2.11(!RESET)
N$4: L11.2 U2.16(AD0/GIO7)
N$5: L9.2 U2.14(BCLK/GIO5)
N$6: C94.2 R36.1 U11.22(SNS7K/DETECT0)
N$7: R2.2 U1.15(BIAS)
N$8: R1.1 U1.7(HGM)
N$9: C22.2 SMA.SIG
N$10: AVR1.A R5.1
N$11: PLAY/PAUSE.P$1 R36.2
N$12: AVR.A R8.1
N$13: L4.1 U1.11(ANT)
N$14: C23.1 L4.2 L5.1
N$15: C21.1 L5.2
N$16: C21.2 C22.1 C24.1 L6.2
N$17: C94.1 U11.23(SNS7/DETECT1)
N$18: L12.1 U2.36(XPAEN)
N$19: R3.2 U2.30(RBIAS)
N$20: C52.2 C98.1 R9.2
N$21: C25.1 U2.39(DCPL)
N$22: C71.1 L21.1 U7.1(VIN) U7.3(EN)
N$23: L8.2 U2.13(MCLK/GIO4)
N$24: C67.2 C99.1 R14.2
N$25: L10.2 U2.15(WCLK/GIO6)
N$26: C63.1 U4.1(BYPASS)
N$27: L13.2 U2.17(AD1/GIO8)
N$28: R4.1 U2.9(GIO3)
N$29: CC1.C R4.2
N$30: C90.2 R32.1 U11.9(SNS3K)
N$31: POWER.A R12.1
N$32: CHARGE.C U6.8(!CHG)
N$33: CHARGE.A R11.1
N$34: C68.1 C69.1 U10.141(P:VDDCORE)
N$35: U9.5(CLK_IN) U10.45(X:PX37)
N$39: R17.1 U10.8(M:D-_FS)
N$40: C66.1 R21.1 U4.5(OUTB)
N$41: C91.2 R33.1 U11.11(SNS4K)
N$42: C92.2 R34.1 U11.13(SNS5K)
N$43: C87.2 R29.1 U11.1(SNS0K)
N$44: R38.2 U6.2(ISET)
N$45: C88.2 R30.1 U11.3(SNS1K)
N$46: R15.1 U10.9(M:D+_FS)
N$47: C76.1 R27.2 U10.3(M:USB_VBIAS)
N$49: C67.1 R40.1
N$50: F1.2 L21.2 U5.1(VIN)
N$51: C52.1 R41.1
N$52: C83.1 U10.18(C:PC02) X2.X1
N$53: R7.2 R9.1 U4.8(INA)
N$54: R14.1 R21.2 U4.4(INB)
N$55: R10.1 U4.3(SHUTDOWN)
N$56: LED_UL.1(KR) LED_UL.1-2(KR) LED_UR.1(KR) LED_UR.1-2(KR) Q2.3(D)
N$57: C84.1 U10.19(C:PC03) X2.X2
N$58: LED_UL.4(KG) LED_UL.4-2(KG) LED_UR.4(KG) LED_UR.4-2(KG) Q4.3(D)
N$59: C87.1 U11.32(SNS0)
N$60: C90.1 U11.8(SNS3)
N$61: R32.2 VOL+.P$1
N$62: C91.1 U11.10(SNS4)
N$63: R33.2 WIRELESS.P$1
N$64: C92.1 U11.12(SNS5)
N$65: R34.2 VOL-.P$1
N$66: R37.2 U6.9(TS)
N$67: C54.1 L17.1 TO_AUX1.1 TO_AUX1.2
N$69: R39.2 U6.4(PRETERM)
N$71: C93.2 R35.1 U11.19(SNS6K)
N$72: PREV.P$1 R35.2
N$76: C93.1 U11.20(SNS6)
N$77: R28.1 U11.29(!RESET)
N$78: LED_UL.3(KB) LED_UL.3-2(KB) LED_UR.3(KB) LED_UR.3-2(KB) Q6.3(D)
N$79: LED_LL.1(KR) LED_LL.1-2(KR) LED_LR.1(KR) LED_LR.1-2(KR) Q3.3(D)
N$80: LED_LL.4(KG) LED_LL.4-2(KG) LED_LR.4(KG) LED_LR.4-2(KG) Q5.3(D)
N$83: LED_LL.3(KB) LED_LL.3-2(KB) LED_LR.3(KB) LED_LR.3-2(KB) Q7.3(D)
N$84: C62.1 L19.1 TO_AUX2.2 TO_AUX2.4
N$85: R29.2 STOP.P$1
N$86: C88.1 U11.2(SNS1)
N$87: NEXT.P$1 R30.2
N$88: C46.1 C47.1 U3.17(VQ)
N$89: C44.1 C45.1 U3.18(FILT+)
N$90: C89.2 R31.1 U11.6(SNS2K)
N$91 [Analog]: C36.2 U3.15(AINA)
N$92 [Analog]: C38.2 U3.16(AINB)
N$93: C89.1 U11.7(SNS2)
N$94: C82.1 U9.6(FILTP)
N$95: BUTTON.P$1 R31.2
OUT_L: R41.2 U3.23(OUTB)
OUT_R: R40.2 U3.22(OUTA)
PA_EN: L12.2 R6.2 U1.5(PAEN)
PHONE_L: C53.2 PHONE_OUT.4(L) R25.2
PHONE_R [Analog]: C66.2 PHONE_OUT.1(R)
PHONE_SENSE: PHONE_OUT.3(L_SW) R16.1 U10.115(A:PA18)
RED_BOT: TO_AUX1.4 U10.132(A:PA12)
RED_TOP: TO_AUX1.7 U10.83(X:PX17)
RF_N: U1.2(RF_N) U2.25(RF_N)
RF_P: U1.4(RF_P) U2.24(RF_P)
RTS: SERIAL.1 U10.63(X:PX03)
RXD: SERIAL.3 U10.55(X:PX00)
SCLK0: CC_DEBUG.6 U2.4(SCLK) U3.10(SCL/SCLK) U9.9(SCL/SCLK) U10.137(A:PA08)
SCLK1: TO_AUX2.1 U10.135(B:PB07)
TCK: JTAG.1 U10.107(M:TCK)
TDI: JTAG.9 U10.108(M:TDI)
TDO: JTAG.3 U10.105(M:TDO)
TMS: JTAG.5 U10.104(M:TMS)
TXD: SERIAL.2 U10.59(X:PX01)
UC_MCLK: U8.1(D) U8.4(!Q) U10.13(C:PC04)
USBOTGID: U10.121(B:PB05) USB.4(ID)
VBUS [Power]: C59.1 U6.1(IN) U10.1(P:USB_VBUS) USB.1(VBUS)
WCLK: L10.1 U3.2(WCLK) U10.44(X:PX36) U10.89(X:PX27) U10.90(X:PX26)
Unconnected: CC_DEBUG.3 CC_DEBUG.4 CC_DEBUG.9 GPIO.1 GPIO.3 JTAG.7 JTAG.8 LINE_IN.2(R_SW) PHONE_OUT.2(R_SW) RESET.2 RESET.4 SERIAL.4 U1.3(RXTX) U2.1(USBN/XANTN) U2.2(USBP/XANTP) U2.8(GIO2) U3.13(AD2) U6.5(!PG) U9.4(AUX_OUT) U10.12(C:PC05) U10.15(A:PA02) U10.17(B:PB09) U10.22(B:PB04) U10.24(B:PB03) U10.25(B:PB02) U10.31(B:PB11) U10.32(X:PX16) U10.33(X:PX13) U10.35(X:PX19) U10.36(X:PX40) U10.37(X:PX10) U10.39(X:PX47) U10.41(X:PX48) U10.42(X:PX53) U10.43(X:PX49) U10.46(X:PX54) U10.49(X:PX09) U10.52(X:PX39) U10.53(X:PX06) U10.54(X:PX07) U10.56(X:PX59) U10.57(X:PX58) U10.58(X:PX05) U10.60(X:PX04) U10.66(X:PX44) U10.67(X:PX11) U10.69(X:PX42) U10.70(X:PX45) U10.71(X:PX41) U10.72(X:PX22) U10.73(X:PX20) U10.76(X:PX57) U10.77(X:PX51) U10.78(X:PX56) U10.79(X:PX55) U10.80(X:PX21) U10.87(X:PX52) U10.88(X:PX43) U10.94(X:PX29) U10.98(C:PC00) U10.99(C:PC01) U10.101(A:PA15) U10.109(A:PA21) U10.110(A:PA22) U10.113(A:PA20) U10.119(A:PA25) U10.120(A:PA26) U10.122(A:PA00) U10.123(A:PA01) U10.124(A:PA05) U10.128(A:PA16) U10.134(B:PB06) U11.24(SNS8/DETECT2) U11.25(SNS8K/DETECT3) U11.26(SNS9/DETECT4) U11.27(SNS9K/DETECT5) U11.30(SNS10/DETECT16) U11.31(SNS10K/SYNC)

## Notes on the sheet
- Wireless SoC | LNA/PA
- See Note
- AVDD traces act as transmission lines
- Trace length at w=0.254mm
- AVDD_PA1 1.85mm
- AVDD_PA2 2.40mm
- AVDD_LNA 6.90mm
- Lowest value cap should be placed closest to pin
- Parts with '_HF' should be rated to >2.4GHz
- Control
- Audio
- Power
- Ensure pull-up on !SD_CARD
- UC_MCLK is either:
  12.288MHz (n*48kHz)
  11.2896MHz (n*44.1kHz)
- MCLK is either:
  24.576MHz (n*48kHz)
  22.5792MHz (n*44.1kHz)

## Library data of the parts
AVR AVR1 CC1 CHARGE POWER = SparkFun-LED:LED: LEDs Standard schematic elements and footprints for 5mm, 3mm, 1206, and 0603 sized LEDs. 5mm - Spark Fun Electronics SKU : COM-00529 (and others)
BATTERY = 00-EvaLibrary:BATTERY
BUTTON NEXT PLAY/PAUSE PREV STOP VOL+ VOL- WIRELESS = 00-EvaLibrary:TOUCH_PAD
C1-C36 C38-C69 C71-C95 C98 C99 = 00-EvaLibrary:C-EU: CAPACITOR, European symbol
C37 C70 = rcl:C-EU: CAPACITOR, European symbol
CC_DEBUG JTAG TO_AUX1 TO_AUX2 TO_MAIN1 TO_MAIN2 = 00-EvaLibrary:HEADER-10P
F1 = 00-EvaLibrary:PTC_FUSE
GPIO RESET = 00-EvaLibrary:TACT_SWITCH
L1-L11 L13 L14 L17 L19-L21 = 00-EvaLibrary:INDUCTOR: Inductors Basic Inductor/Choke - 0603 and 1206. Footprints are not proven and vary greatly between part numbers.
L12 L15 L16 = SparkFun-Passives:INDUCTOR: Inductors Basic Inductor/Choke - 0603 and 1206. Footprints are not proven and vary greatly between part numbers.
LED_LL LED_LR LED_UL LED_UR = 00-EvaLibrary:LED_RGB
LINE_IN PHONE_OUT = 00-EvaLibrary:PHONE_SW
Q2-Q7 = SparkFun-DiscreteSemi:MOSFET-NCHANNEL: Generic NMOS footprint
R1-R9 R11-R22 R24-R41 = 00-EvaLibrary:R-US_: RESISTOR, American symbol
R10 = rcl:R-US_: RESISTOR, American symbol
SD1 = 00-EvaLibrary:MICROSD
SERIAL = 00-EvaLibrary:HEADER-6X1
SMA = 00-EvaLibrary:SMA
U1 = 00-EvaLibrary:CC2591
U2 = 00-EvaLibrary:CC85XX
U3 = 00-EvaLibrary:CS4270
U4 = 00-EvaLibrary:LM4881
U5 = 00-EvaLibrary:MCP1826
U6 = 00-EvaLibrary:BQ2409X
U7 = 00-EvaLibrary:TLV700
U8 = 00-EvaLibrary:SN74LVC1G80
U9 = 00-EvaLibrary:CS2300
U10 = 00-EvaLibrary:AT32UC3A3
U11 = 00-EvaLibrary:AT42QT1110
USB = 00-EvaLibrary:USB_MICRO_AB
X1 X2 = 00-EvaLibrary:XTAL-ABRACON